# Altium schematic sheet esp12f.SchDoc
size A4
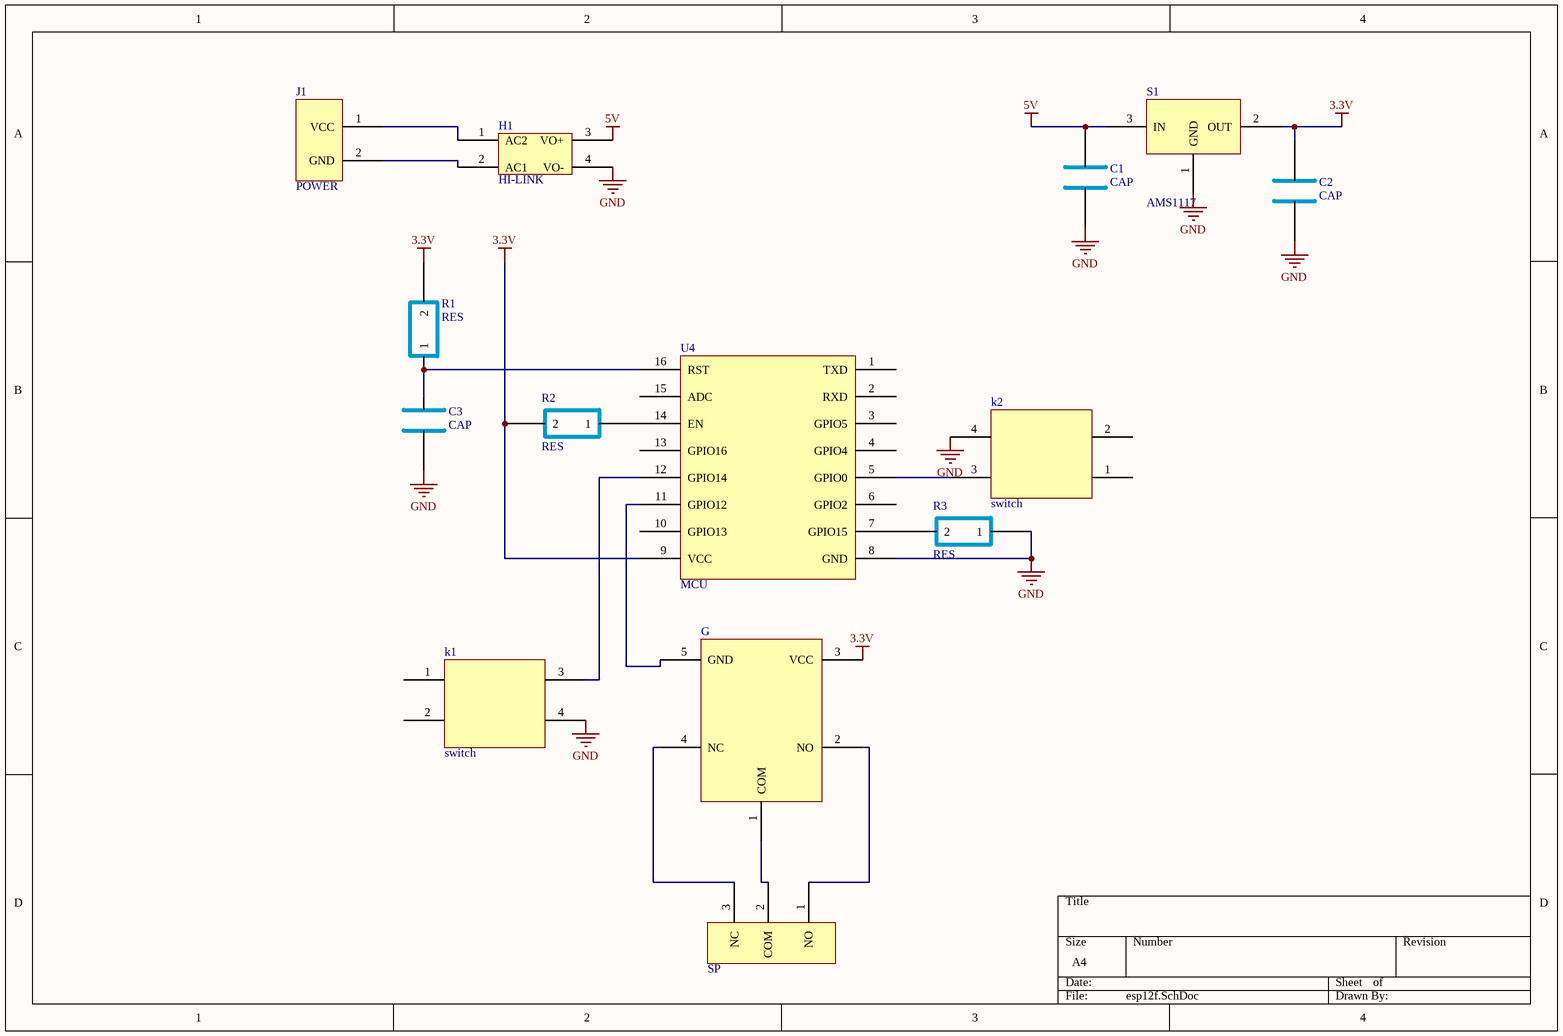
[diagram p0: esp12f.SchDoc]

## Parts
C1  CAP  [CB2]
C2  CAP  [CB2]
C3  CAP  [CB2]
G  jidianqi  [jidianqi]  (value not drawn)
H1  HI-LINK  [Hi-Link]
J1  POWER  [SIP02]
k1  switch  [SWITCH]
k2  switch  [SWITCH]
R1  RES  [RAD0.3]
R2  RES  [RAD0.3]
R3  RES  [RAD0.3]
S1  AMS1117
SP  SPI3  [SIPX03]  (value not drawn)
U4  MCU  [esp12f]

## Nets
3.3V: C2.1 G.3(VCC) R1.2 R2.2 S1.2(OUT) U4.9(VCC)
5V: C1.1 H1.3(VO+) S1.3(IN)
GND: C1.2 C2.2 C3.2 H1.4(VO-) k1.4 k2.4 R3.1 S1.1(GND) U4.8(GND)
NetC3_1: C3.1 R1.1 U4.16(RST)
NetG_1: G.1(COM) SP.2(COM)
NetG_2: G.2(NO) SP.1(NO)
NetG_4: G.4(NC) SP.3(NC)
NetG_5: G.5(GND) U4.11(GPIO12)
NetH1_1: H1.1(AC2) J1.1(VCC)
NetH1_2: H1.2(AC1) J1.2(GND)
Netk1_3: k1.3 U4.12(GPIO14)
Netk2_3: k2.3 U4.5(GPIO0)
NetR2_1: R2.1 U4.14(EN)
NetR3_2: R3.2 U4.7(GPIO15)

Not connected (* = marked no-connect by the designer): k1 1 2(24); k2 1 2(24); U4 1(TXD) 2(RXD) 3(GPIO5) 4(GPIO4) 6(GPIO2) 10(GPIO13) 13(GPIO16) 15(ADC)

## Library data of the parts
J1 = CON2
U4 = ESP12F